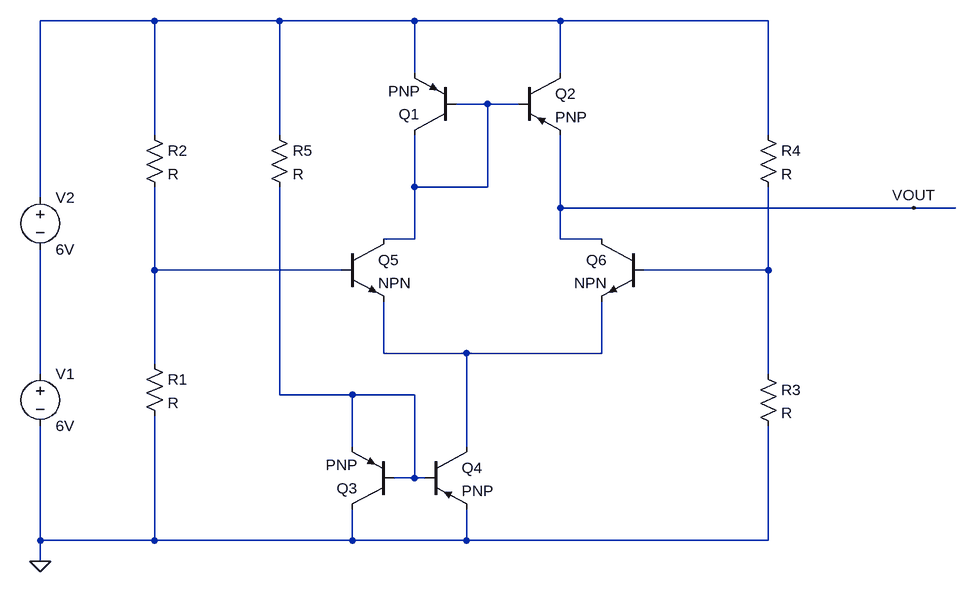
[diagram p0: schematic Test5.asc]
Test5.asc, the LTspice schematic file:
Version 4
SHEET 1 880 756
WIRE -464 -96 -640 -96
WIRE -272 -96 -464 -96
WIRE -64 -96 -272 -96
WIRE 160 -96 -64 -96
WIRE 480 -96 160 -96
WIRE -64 -16 -64 -96
WIRE 160 -16 160 -96
WIRE 48 32 0 32
WIRE 96 32 48 32
WIRE -464 80 -464 -96
WIRE -272 80 -272 -96
WIRE 480 80 480 -96
WIRE -64 160 -64 80
WIRE 48 160 48 32
WIRE 48 160 -64 160
WIRE -640 176 -640 -96
WIRE 160 192 160 80
WIRE 704 192 160 192
WIRE 768 192 704 192
WIRE -64 240 -64 160
WIRE -64 240 -112 240
WIRE 160 240 160 192
WIRE 224 240 160 240
WIRE -464 288 -464 160
WIRE -176 288 -464 288
WIRE 480 288 480 160
WIRE 480 288 288 288
WIRE -112 416 -112 336
WIRE 16 416 -112 416
WIRE 224 416 224 336
WIRE 224 416 16 416
WIRE -464 432 -464 288
WIRE -640 448 -640 256
WIRE 480 448 480 288
WIRE -272 480 -272 160
WIRE -160 480 -272 480
WIRE -64 480 -160 480
WIRE -160 560 -160 480
WIRE 16 560 16 416
WIRE -64 608 -64 480
WIRE -64 608 -96 608
WIRE -48 608 -64 608
WIRE -640 704 -640 528
WIRE -464 704 -464 512
WIRE -464 704 -640 704
WIRE -160 704 -160 656
WIRE -160 704 -464 704
WIRE 16 704 16 656
WIRE 16 704 -160 704
WIRE 480 704 480 528
WIRE 480 704 16 704
WIRE -640 736 -640 704
FLAG -640 736 0
FLAG 704 192 VOUT
SYMBOL pnp 0 80 R180
SYMATTR InstName Q1
SYMBOL pnp 96 -16 R0
SYMATTR InstName Q2
SYMBOL pnp -96 656 R180
SYMATTR InstName Q3
SYMBOL pnp -48 560 R0
SYMATTR InstName Q4
SYMBOL npn -176 240 R0
SYMATTR InstName Q5
SYMBOL npn 288 240 M0
SYMATTR InstName Q6
SYMBOL res -480 416 R0
SYMATTR InstName R1
SYMBOL res -480 64 R0
SYMATTR InstName R2
SYMBOL res 464 432 R0
SYMATTR InstName R3
SYMBOL res 464 64 R0
SYMATTR InstName R4
SYMBOL res -288 64 R0
SYMATTR InstName R5
SYMBOL voltage -640 432 R0
WINDOW 123 0 0 Left 0
WINDOW 39 0 0 Left 0
SYMATTR InstName V1
SYMATTR Value 6V
SYMBOL voltage -640 160 R0
WINDOW 123 0 0 Left 0
WINDOW 39 0 0 Left 0
SYMATTR InstName V2
SYMATTR Value 6V

The netlist it stands for:
* Test5.asc
Q1 N002 N002 N001 0 PNP
Q2 N001 N002 VOUT 0 PNP
Q3 0 N007 N007 0 PNP
Q4 N005 N007 0 0 PNP
Q5 N002 N003 N005 0 NPN
Q6 VOUT N004 N005 0 NPN
R1 N003 0 R
R2 N001 N003 R
R3 N004 0 R
R4 N001 N004 R
R5 N001 N007 R
V1 N006 0 6V
V2 N001 N006 6V
.model NPN NPN
.model PNP PNP
.lib standard.bjt
.backanno
.end